# EAGLE design trinKey (EAGLE 6.5.0)
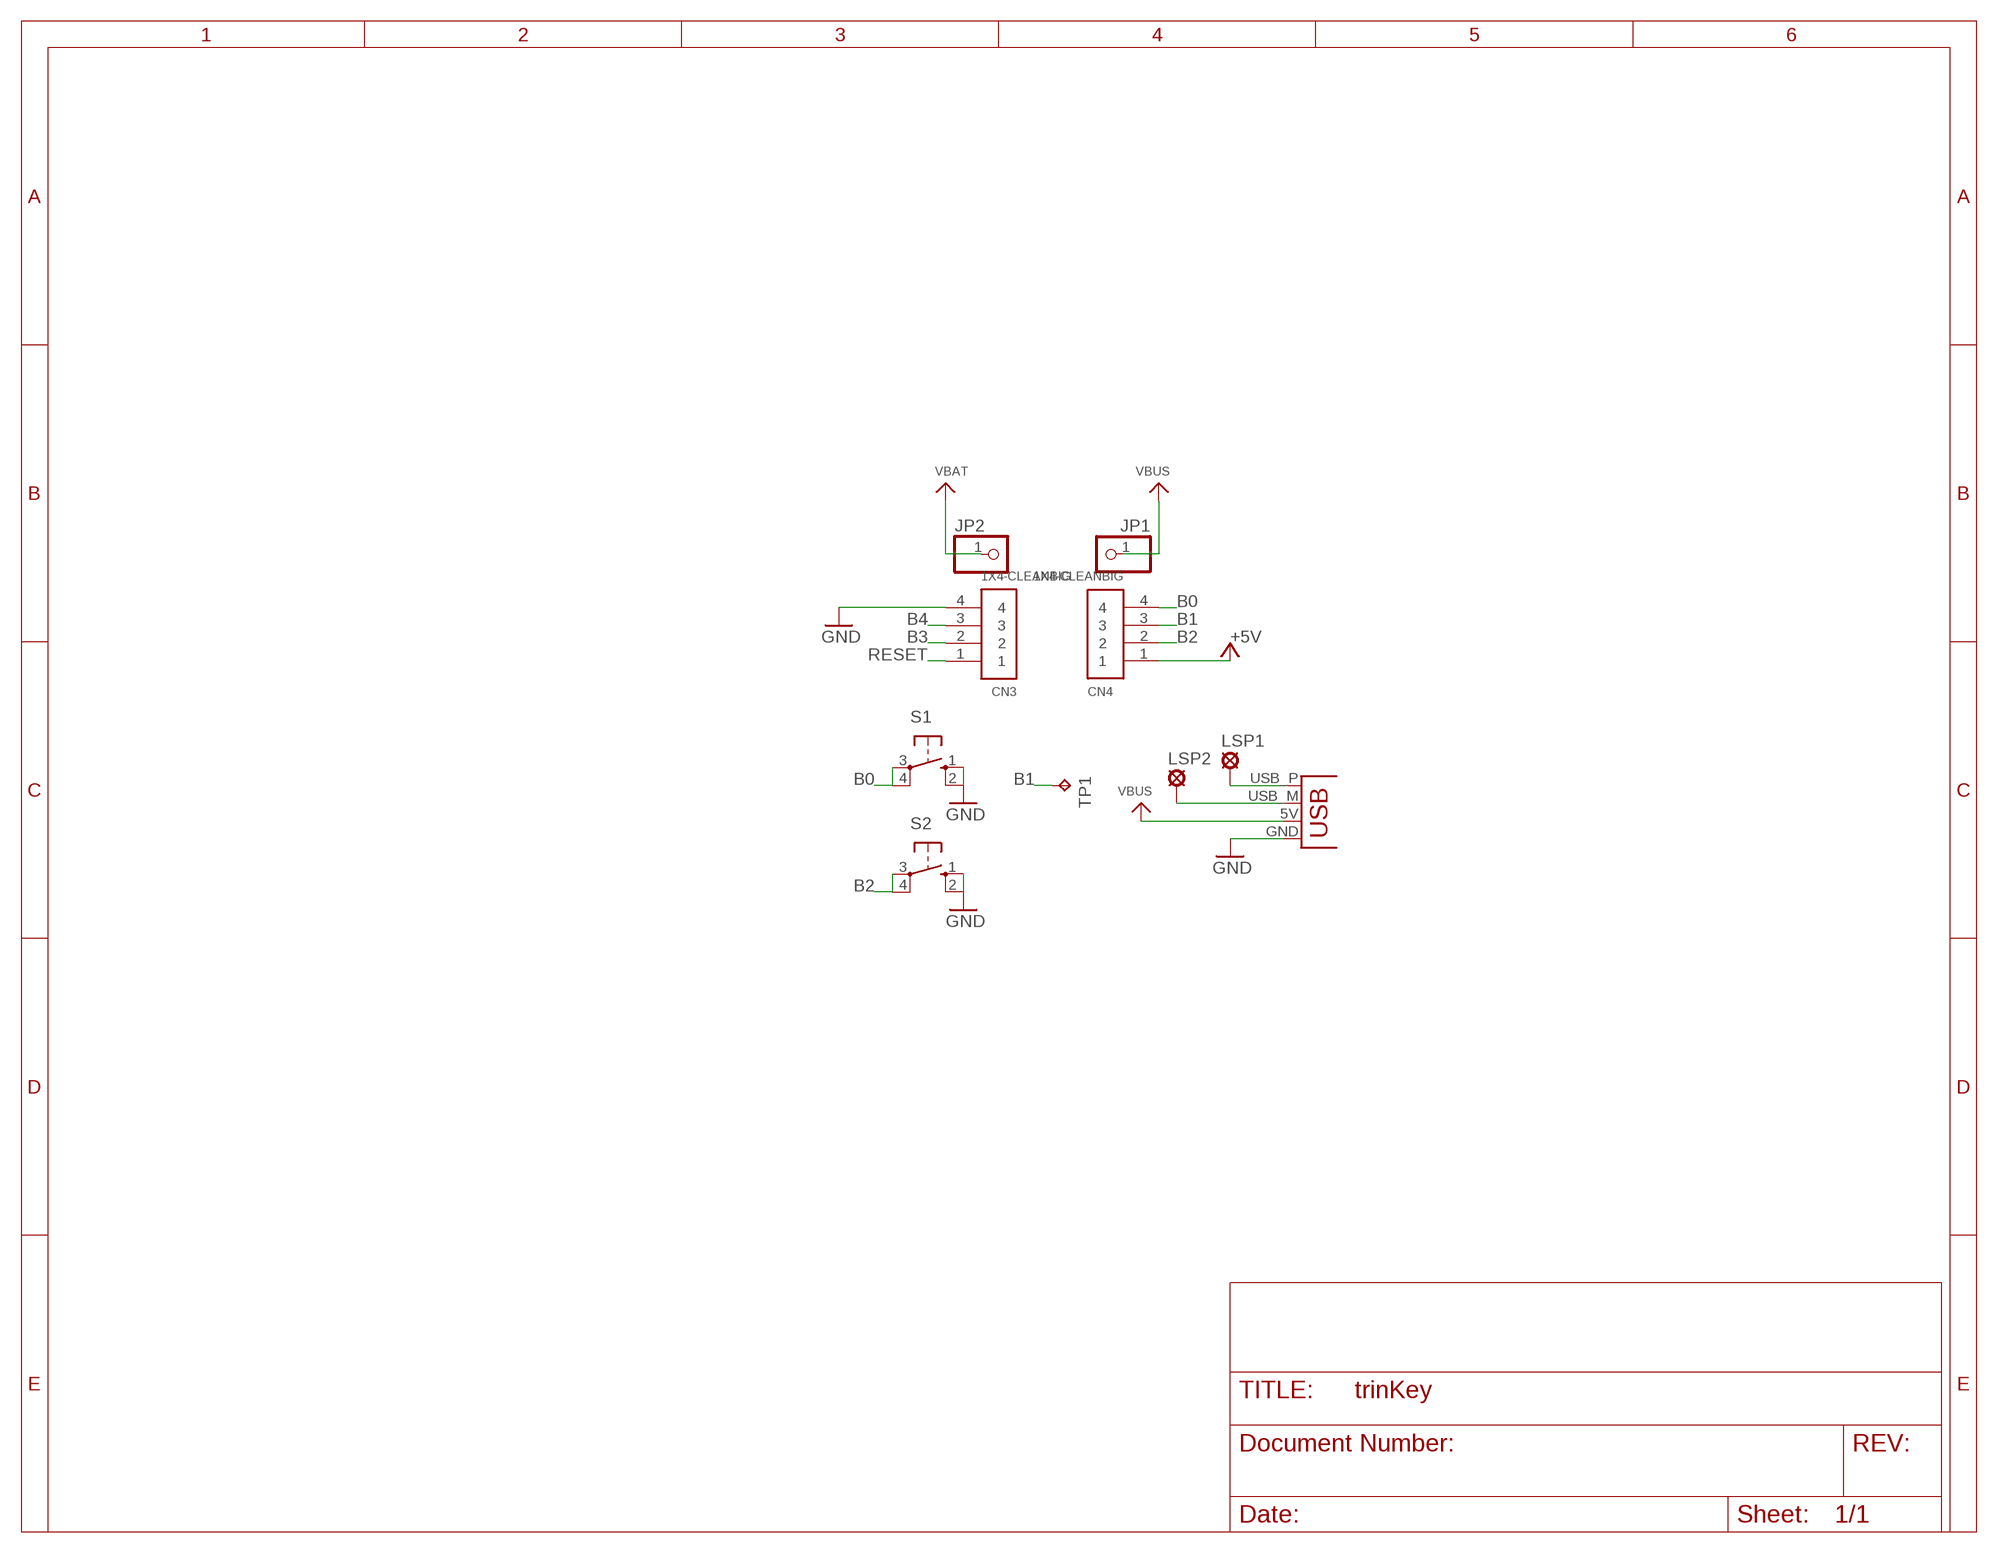
[diagram p0: schematic, sheet 1]

## Parts
CN3  1X4-CLEANBIG  [1X04-CLEANBIG]
CN4  1X4-CLEANBIG  [1X04-CLEANBIG]
JP1  PINHD-1X1CB  [1X01-CLEANBIG]
JP2  PINHD-1X1CB  [1X01-CLEANBIG]
JP4  USBPCB  [USB-A-PCB]
LSP1  LSP10  [LSP10]
LSP2  LSP10  [LSP10]
S1  10-XX  [B3F-10XX]
S2  10-XX  [B3F-10XX]
TP1  TPB1,27  [B1,27]

## Nets
+5V: CN4.1
B0: CN4.4 S1.3(P) S1.4(P1)
B1: CN4.3 TP1.TP
B2: CN4.2 S2.3(P) S2.4(P1)
B3: CN3.2
B4: CN3.3
GND: CN3.4 JP4.GND S1.1(S) S1.2(S1) S2.1(S) S2.2(S1)
N$1: JP4.USB_P(D+) LSP1.MP
N$2: JP4.USB_M(D-) LSP2.MP
RESET: CN3.1
VBAT: JP2.1
VBUS: JP1.1 JP4.5V(VBUS)

## Library data of the parts
CN3 CN4 = adafruit:1X4: 4-pin connector
JP1 JP2 = adafruit:PINHD-1X1: Pin header 1x1 for 0.1" spacing With round pins
JP4 = SparkFun-Connectors:USB: USB Connectors USB-B-PTH is fully proven SKU : PRT-00139/CONN-08278 USB-miniB is fully proven SKU : PRT-00587 USB-A-PCB is untested. USB-A-H is throughly reviewed, but untested. Spark Fun Electronics SKU : PRT-00437 USB-B-SMT is throughly reviewed, but untested. Needs silkscreen touching up. USB-A-S has not been used/tested USB-MB-H has not been used/tested USB-MICROB has been used. CONN-09505
LSP1 LSP2 = solpad:LSP10: SOLDER PAD drill 1.0 mm, distributor Buerklin, 12H555
S1 S2 = switch-omron:10-XX: OMRON SWITCH; MPN: B3F-1000; OC_FARNELL: 176432; OC_NEWARK: 36M3542
TP1 = testpad:TP: Test pad

## Net classes
1 power: width 0.305 mm

## Board
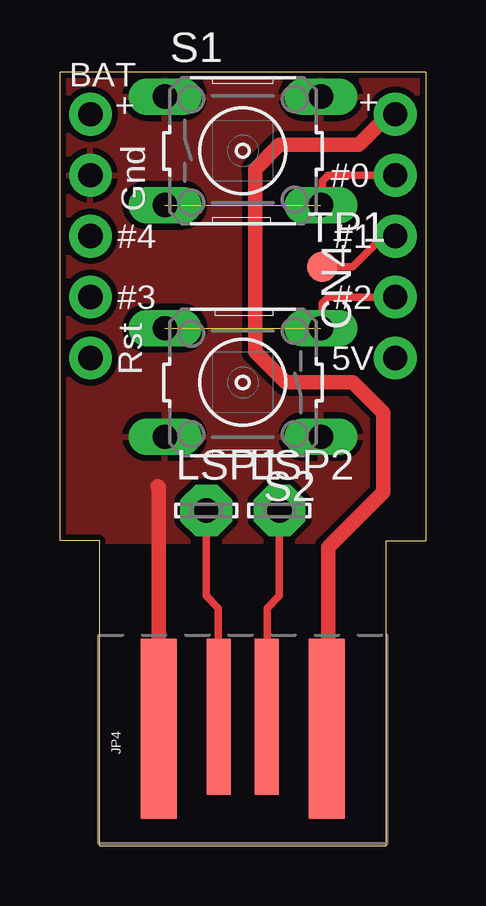
[diagram p1: board, top side]

Size 15.24 x 32.26 mm. Coordinates in mm from the lower left corner, seen from the top.
Outline: 15.24,32.26 15.24,12.7 13.59,12.7 13.59,0 1.65,0 1.65,12.7 0,12.7 0,32.26 15.24,32.26
Copper layers (1*16): Top 0.035mm / dielectric 1.5mm / Bottom 0.035mm
Design rules "adafruit *": minimum track width 8mil, minimum drill 15.5mil, track to track 10mil, track to pad 10mil, pad to pad 10mil, via to via 10mil, smd to smd 8mil, copper to edge 10mil, drill to drill 8mil, minimum pad ring 10mil, minimum via ring 8mil, stop-mask expansion 4mil, vias tented up to drill 20mil, thermal gap 10mil

### Footprints (pad centres in the part's own frame; a part is rotated, then mirrored left to right if it is on the bottom)
1X04-CLEANBIG = drill 1.016 pad 1.778: 1 -3.81,0; 2 -1.27,0; 3 1.27,0; 4 3.81,0
1X01-CLEANBIG = drill 1.016 pad 1.778: 1 0,0
USB-A-PCB = smd 7.5 x 1.5: 5V -0.2,-3.5; GND -0.2,3.5 | smd 6.5 x 1: USB_M 0.3,-1; USB_P 0.3,1
LSP10 = drill 1.016 pad 2.159 octagon: MP 0,0
B3F-10XX = drill 1.016 long: 1 -3.251,2.261; 2 3.251,2.261; 3 -3.251,-2.261; 4 3.251,-2.261
B1,27 = smd 1.27 x 1.27: TP 0,0

### Placement (x,y rotation side)
CN3  1.27,24.13 90 top
CN4  13.97,24.13 90 top
JP1  13.97,30.48 0 top
JP2  1.27,30.48 0 top
JP4  7.62,5.08 90 top
LSP1  6.1,13.97 0 top
LSP2  9.14,13.97 0 top
S1  7.62,28.96 0 top
S2  7.62,19.3 180 top
TP1  10.92,24.13 0 top

### Tracks (layer width: path | path; a pad name or v marks a point on that pad's centre or on a via)
B0  (1 unrouted)
  Top 0.305: CN4.4 11.18,27.94 10.92,27.69 10.92,26.75 S1.4
B1
  Top 0.305: CN4.3 13.46,25.4 12.19,24.13 TP1.TP
B2  (1 unrouted)
  Top 0.305: CN4.2 11.18,22.86 10.92,22.61 10.92,21.61 S2.3
GND
  Top 0.61: JP4.GND 4.12,14.93 4.06,14.99
  pour Top: 0,32.26 0,12.7 15.24,12.7 15.24,32.26
N$1
  Top 0.305: LSP1.MP 6.1,10.41 6.6,9.91 6.6,5.4 JP4.USB_P
N$2
  Top 0.305: LSP2.MP 9.14,10.41 8.64,9.91 8.64,5.4 JP4.USB_M
VBUS
  Top 0.61: JP1.1 13.72,30.48 12.45,29.21 9.14,29.21 8.13,28.19 8.13,20.57 9.4,19.3 12.19,19.3 13.46,18.03 13.46,14.73 11.18,12.45 11.18,4.94 JP4.5V

### Text on the board
tPlace: BAT | + | + | Gnd | #0 | #4 | #1 | #3 | #2 | Rst | 5V